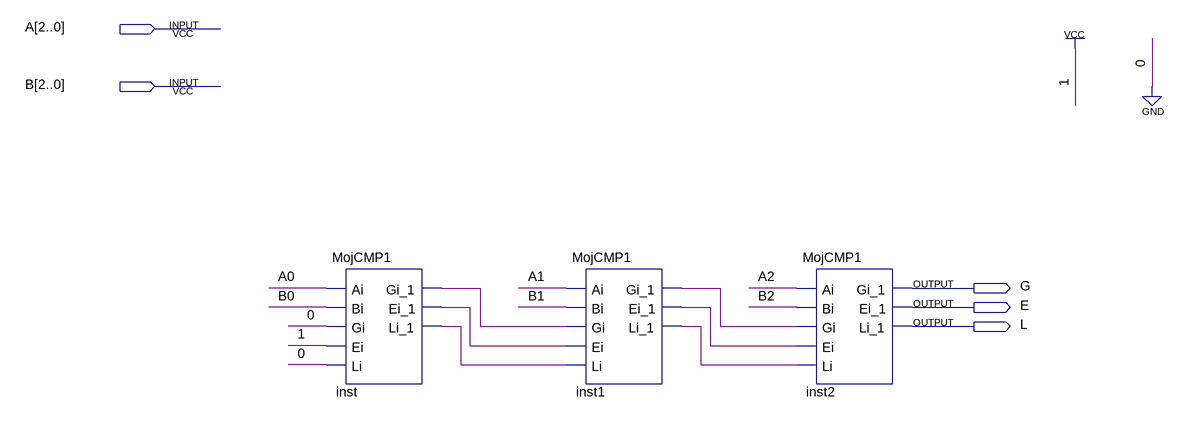
[diagram p0: schematic sheet]
// Quartus schematic MojCMP3.bdf as structural Verilog: 3 symbols, 5 pins
module MojCMP3 (
  input  [2:0] A,
  input  [2:0] B,
  output G,
  output E,
  output L
);

  wire inst1_ei_1, inst1_gi_1, inst1_li_1, inst_ei_1, inst_gi_1, inst_li_1;

  MojCMP1 inst (
    .Ai(A[0]), .Bi(B[0]), .Gi(1'b0), .Ei(1'b1), .Li(1'b0), .Gi_1(inst_gi_1), .Ei_1(inst_ei_1),
    .Li_1(inst_li_1));
  MojCMP1 inst1 (
    .Ai(A[1]), .Bi(B[1]), .Gi(inst_gi_1), .Ei(inst_ei_1), .Li(inst_li_1), .Gi_1(inst1_gi_1),
    .Ei_1(inst1_ei_1), .Li_1(inst1_li_1));
  MojCMP1 inst2 (.Ai(A[2]), .Bi(B[2]), .Gi(inst1_gi_1), .Ei(inst1_ei_1), .Li(inst1_li_1), .Gi_1(G), .Ei_1(E), .Li_1(L));
endmodule
